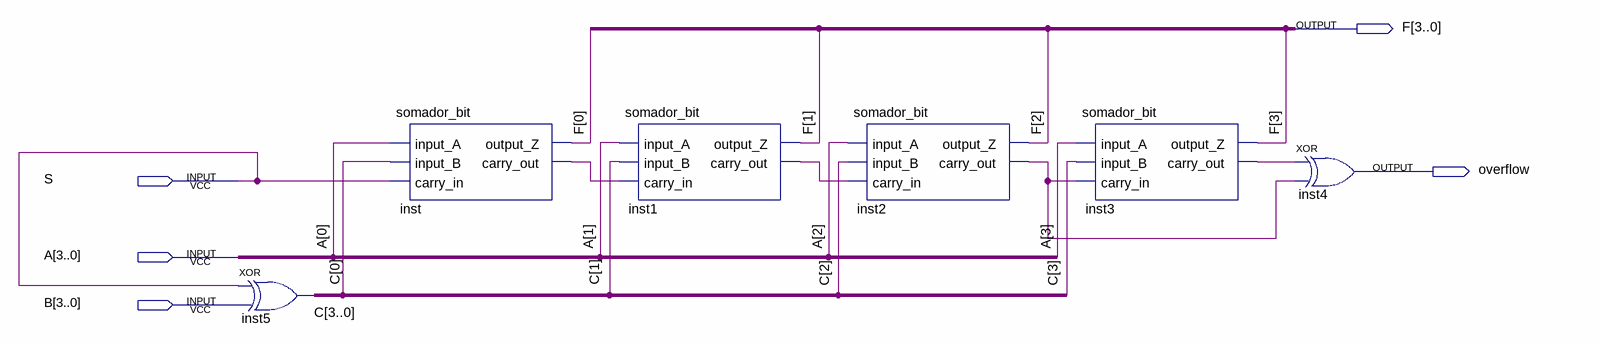
[diagram p0: schematic sheet]
// Quartus schematic somador.bdf as structural Verilog: 6 symbols, 5 pins
module somador (
  input  S,
  input  [3:0] A,
  input  [3:0] B,
  output [3:0] F,
  output overflow
);

  wire inst1_carry_out, inst2_carry_out, inst3_carry_out, inst_carry_out;
  wire [3:0] C;

  assign C = {4{S}} ^ B;  // XOR inst5, 4 bits wide
  somador_bit inst (.input_A(A[0]), .input_B(C[0]), .carry_in(S), .output_Z(F[0]), .carry_out(inst_carry_out));
  somador_bit inst1 (
    .input_A(A[1]), .input_B(C[1]), .carry_in(inst_carry_out), .output_Z(F[1]), .carry_out(inst1_carry_out));
  somador_bit inst2 (
    .input_A(A[2]), .input_B(C[2]), .carry_in(inst1_carry_out), .output_Z(F[2]), .carry_out(inst2_carry_out));
  somador_bit inst3 (
    .input_A(A[3]), .input_B(C[3]), .carry_in(inst2_carry_out), .output_Z(F[3]), .carry_out(inst3_carry_out));
  xor inst4 (overflow, inst3_carry_out, inst2_carry_out);
endmodule
